# EAGLE schematic PCB-schematic-v1 (EAGLE 9.2.0)
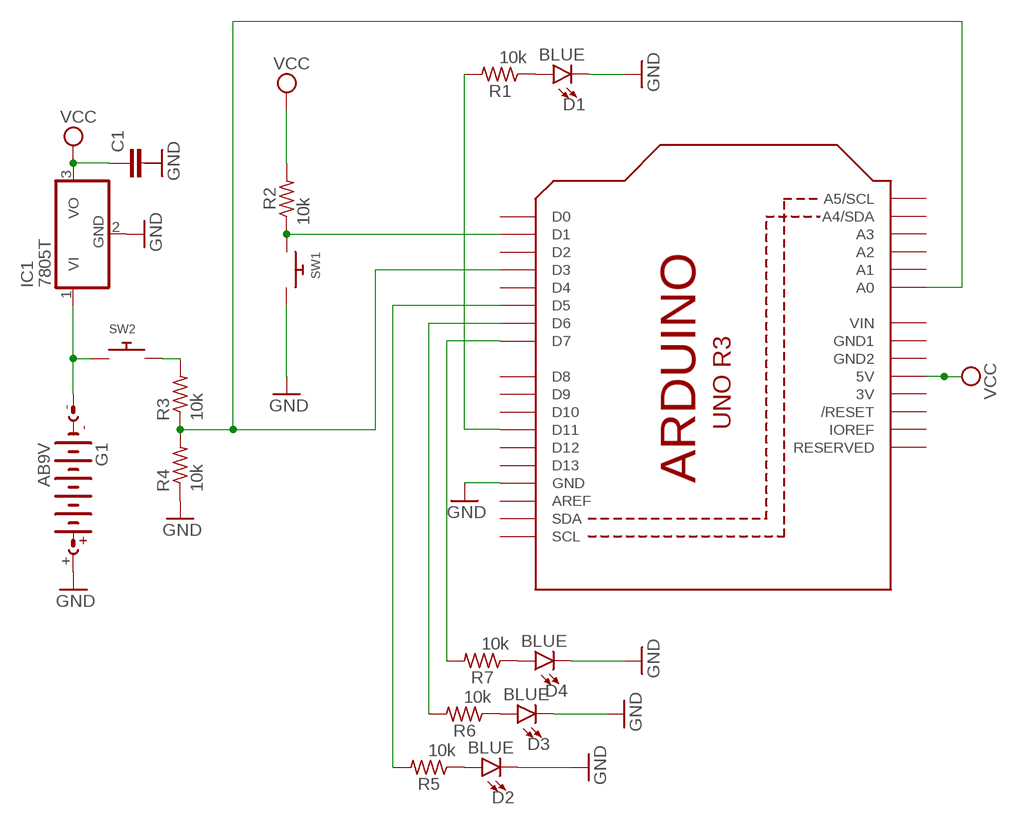
[diagram p0: schematic, sheet 1]

## Parts
C1  C10/5  [C10B5]
D1  BLUE  LED-BLUE1206  [LED-1206]
D2  BLUE  LED-BLUE1206  [LED-1206]
D3  BLUE  LED-BLUE1206  [LED-1206]
D4  BLUE  LED-BLUE1206  [LED-1206]
G1  AB9V  [AB9V]
IC1  7805T  [TO220H]
R1  10k  R-US_R0805  [R0805]
R2  10k  R-US_R0805  [R0805]
R3  10k  R-US_R0805  [R0805]
R4  10k  R-US_R0805  [R0805]
R5  10k  R-US_R0805  [R0805]
R6  10k  R-US_R0805  [R0805]
R7  10k  R-US_R0805  [R0805]
SW1  SWITCH_PUSHBUTTONSOFTTOUCHSMD_SJ  [PUSHBUTTON_SMD_SJ]
SW2  SWITCH_PUSHBUTTONSOFTTOUCHSMD_SJ  [PUSHBUTTON_SMD_SJ]
U1  ARDUINOR3-BPLACE  [ARDUINOR3-BPLACE]

## Nets
GND: D1.C D2.C D3.C D4.C G1.+ IC1.2(GND) R4.1 SW1.P$2 U1.GND
N$1: G1.- IC1.1(VI) SW2.P$1
N$2: R1.2 U1.D11
N$3: D1.A R1.1
N$5: R2.1 SW1.P$1 U1.D1
N$6: R3.2 SW2.P$2
N$7: D2.A R5.1
N$8: R5.2 U1.D5
N$9: D3.A R6.1
N$10: R6.2 U1.D6
N$11: R7.2 U1.D7
N$12: D4.A R7.1
N$13: R3.1 R4.2 U1.A0 U1.D3
VCC: C1.1 IC1.3(VO) R2.2 U1.5V
Unconnected: C1.2 U1.A1 U1.A2 U1.A3 U1.A4(A4/SDA) U1.A5(A5/SCL) U1.AREF U1.D0 U1.D2 U1.D4 U1.D8 U1.D9 U1.D10 U1.D12 U1.D13 U1.IOREF U1.RESERVED U1.RESET(/RESET) U1.SCL U1.SDA

## Power pins joined to a net without a drawn wire
3V: U1.3V
GND1: U1.GND1
GND2: U1.GND2
VIN: U1.VIN

## Library data of the parts
C1 = capacitor-wima:C: CAPACITOR naming: grid - package width
D1-D4 = SparkFun-LED:LED-BLUE: Blue SMD LED Used in manufacturing of various products at SparkFun Packages: 0603 - SMD 0603 package [Product Link] <http://www.digikey.com/product-detail/en/SMLE12BC7TT86/511-1589-2-ND/1641808> 1206 - SMD1206 package [Product Link] <http://www.digikey.com/product-detail/en/lite-on-inc/LTST-C150TBKT/160-1643-1-ND/573584> SparkFun Products: ESP8266 Thing-Dev Board <https://www.sparkfun.com/products/13711> RedBoard <https://www.sparkfun.com/products/12757>; PROD_ID: DIO-09911
G1 = battery:AB9V: 9-V BATTERY CLIP
IC1 = adafruit:78*: Positive VOLTAGE REGULATOR Added bigger pads to the TO-92 package
R1-R7 = rcl:R-US_: RESISTOR, American symbol; SPICEPREFIX: R
SW1 SW2 = adafruit:SWITCH_PUSHBUTTON: Buttons SOFTTOUCHSMD_SJ - Soft touch temporary push button (Super Junk Akihabara) Compatible with SKPMANE010 [Mouser: 688-SKPMAN] C&K_KSS = Digikey: KSS221GLFS
U1 = adafruit:ARDUINOR3: This is a new object for the new Arduino R3 - with extra pins that you may want to use (such as IOref, and duplicated A4/A5